# EAGLE design (Eagle)DriveUnit_B-series(ver1.0) (EAGLE 9.6.2)
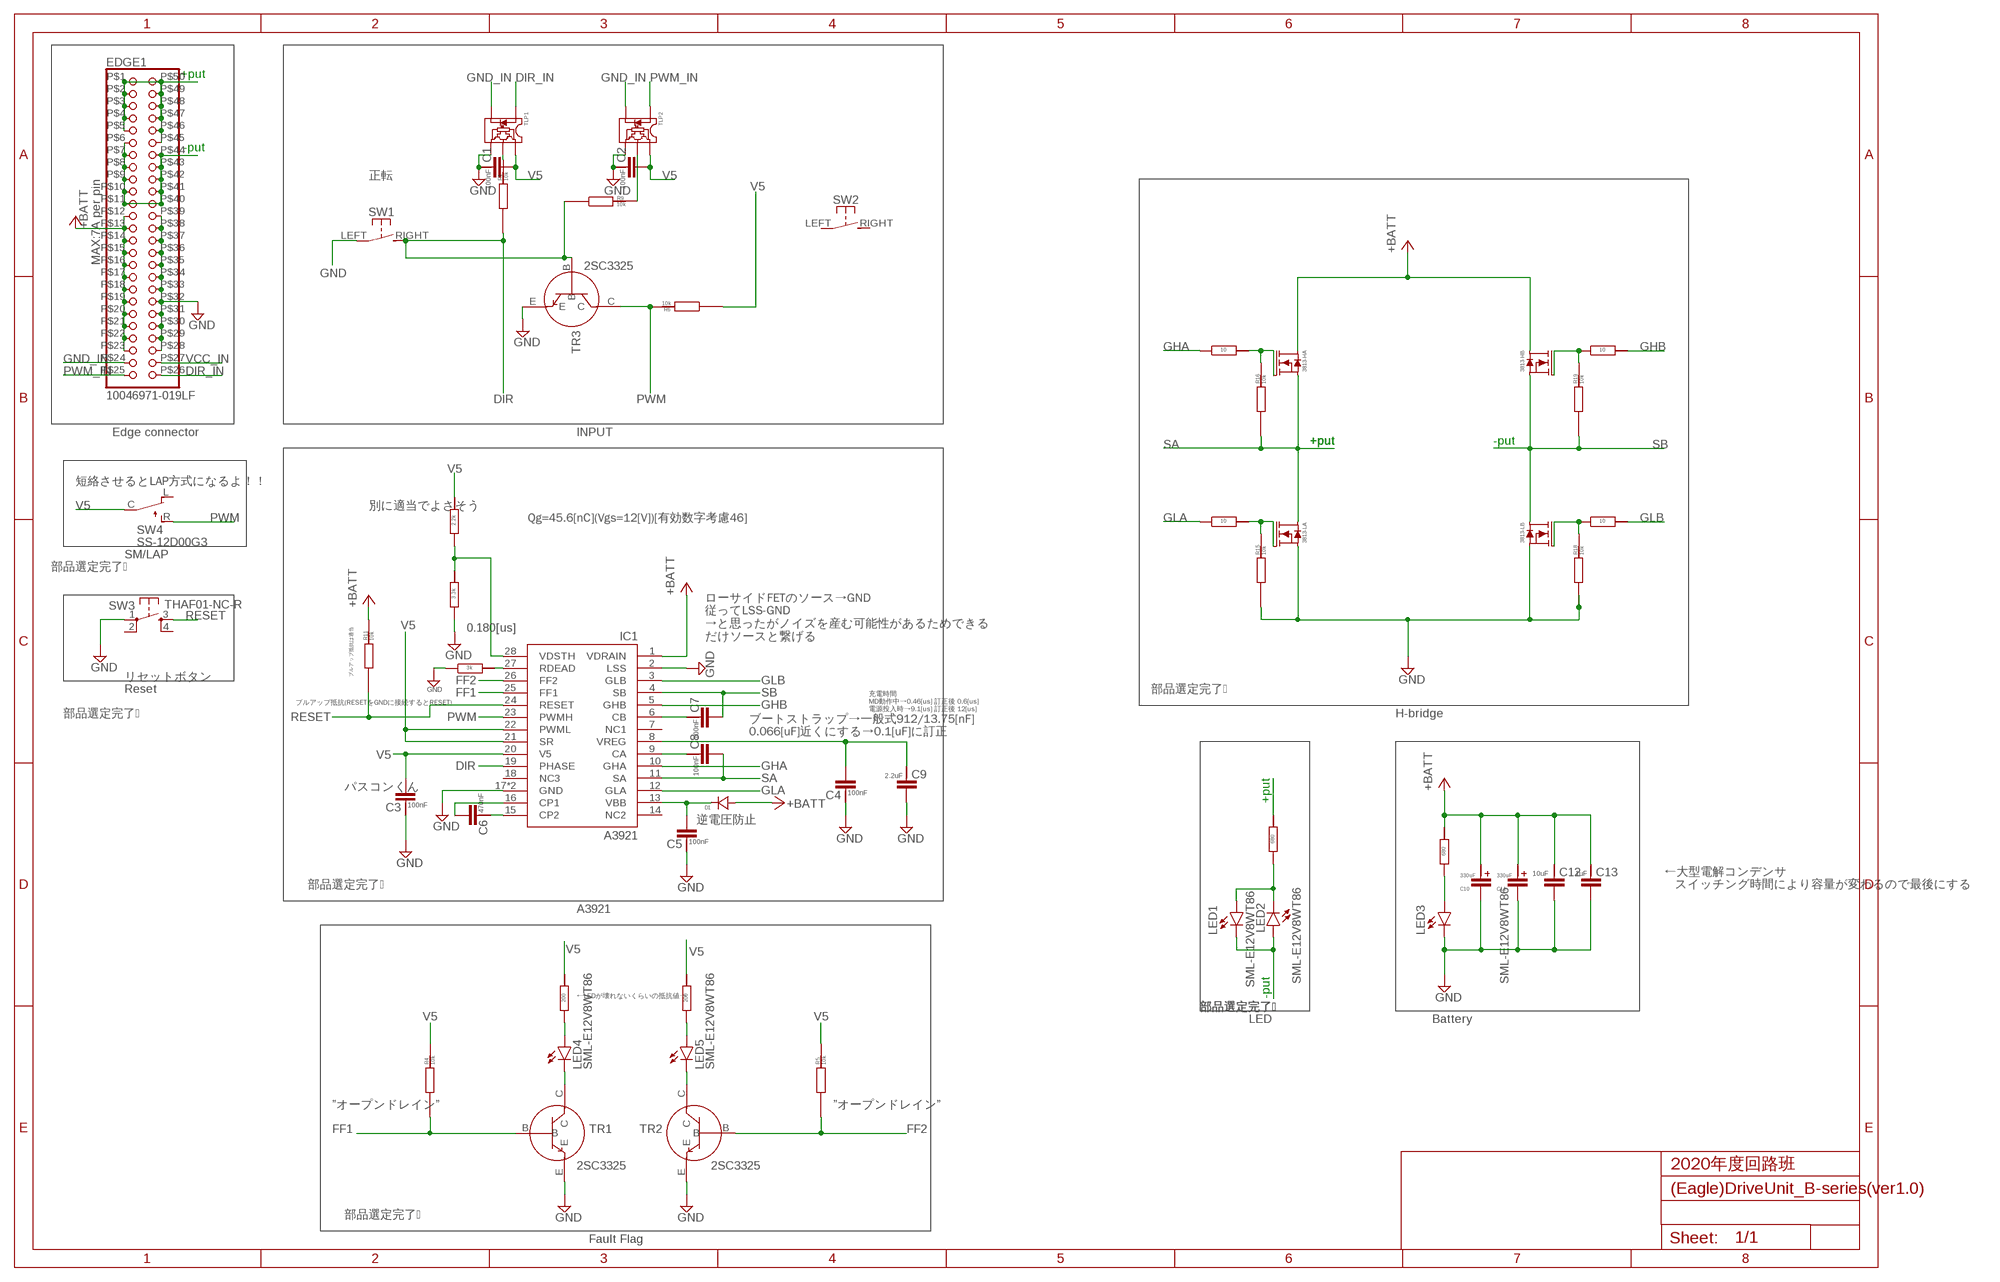
[diagram p0: schematic, sheet 1]

## Parts
3813-HA  IRLB3813NOHOLE  [TO-220AB-NOHOLE]
3813-HB  IRLB3813NOHOLE  [TO-220AB-NOHOLE]
3813-LA  IRLB3813NOHOLE  [TO-220AB-NOHOLE]
3813-LB  IRLB3813NOHOLE  [TO-220AB-NOHOLE]
C1  GCM188L81H104KA57  [GCM188L81H104KA57]
C2  GCM188L81H104KA57  [GCM188L81H104KA57]
C3  GCM188L81H104KA57  [GCM188L81H104KA57]
C4  GCM188L81H104KA57  [GCM188L81H104KA57]
C5  GCM188L81H104KA57  [GCM188L81H104KA57]
C6  GCM21BR71H474KA55  [GCM21BR71H474KA55]
C7  GCM188L81H104KA57  [GCM188L81H104KA57]
C8  GCM188L81H104KA57  [GCM188L81H104KA57]
C9  GRT31CC81H225KE01L  [GRT31CC81H225KE01L]
C10  35PZJ330M10X9  [35PZJ330M10X9]
C11  35PZJ330M10X9  [35PZJ330M10X9]
C12  GRM32ER7YA106KA12  [GRM32ER7YA106KA12]
C13  GRM21BC72A105KE01  [GRM21BC72A105KE01]
D1  GS1010FL  [GS1010FL]
EDGE1  10046971-019LF  [10046971-019LF]
IC1  A3921  [A3921]
LED1  SML-E12V8WT86  [SML-E12V8WT86]
LED2  SML-E12V8WT86  [SML-E12V8WT86]
LED3  SML-E12V8WT86  [SML-E12V8WT86]
LED4  SML-E12V8WT86  [SML-E12V8WT86]
LED5  SML-E12V8WT86  [SML-E12V8WT86]
R1  RG2012  [RG2012]
R2  RG2012N-332-W-T1  [RG2012]
R3  RG2012P-681-B-T5  [RG2012]
R4  RG2012  [RG2012]
R5  RG2012  [RG2012]
R6  RG2012  [RG2012]
R7  RG2012N-201-W-T1  [RG2012]
R8  RG2012N-201-W-T1  [RG2012]
R9  RG2012  [RG2012]
R10  RG2012Q-100-D-T5  [RG2012]
R11  RG2012  [RG2012]
R12  RG2012Q-100-D-T5  [RG2012]
R13  RG2012P-302-B-T5  [RG2012]
R14  RG2012N-222-W-T1  [RG2012]
R15  RG2012  [RG2012]
R16  RG2012  [RG2012]
R18  RG2012  [RG2012]
R19  RG2012  [RG2012]
R20  RG2012Q-100-D-T5  [RG2012]
R21  RG2012Q-100-D-T5  [RG2012]
R22  RG2012P-681-B-T5  [RG2012]
SW1  TVAF06-A020B-R  [TVAF06-A020B-R]
SW2  TVAF06-A020B-R  [TVAF06-A020B-R]
SW3  THAF01-NC-R  [THAF01-NC-R]
SW4  SS-12D00G3  [SS-12D00G3]
TLP1  TLP2366  [TLP2366]
TLP2  TLP2366  [TLP2366]
TR1  2SC3325  [2SC3325]
TR2  2SC3325  [2SC3325]
TR3  2SC3325  [2SC3325]

## Nets
DIR: IC1.19(PHASE) R1.LEFT R9.LEFT SW1.RIGHT(S) TR3.B
DIR_IN: EDGE1.P$26(P26) TLP1.1(ANODE)
FF1: IC1.25(FF1) R4.LEFT TR1.B
FF2: IC1.26(FF2) R5.LEFT TR2.B
GHA: IC1.10(GHA) R21.RIGHT
GHB: IC1.5(GHB) R12.LEFT
GLA: IC1.12(GLA) R20.RIGHT
GLB: IC1.3(GLB) R10.LEFT
GND: 3813-LA.SOURCE(S) 3813-LB.SOURCE(S) C1.P$1 C2.P$1 C3.P$1 C4.P$1 C5.P$1 C9.P$2 C10.C(CATHODE) C11.C(CATHODE) C12.P$2 C13.P$2 EDGE1.P$28(P28) EDGE1.P$29(P29) EDGE1.P$30(P30) EDGE1.P$31(P31) EDGE1.P$32(P32) EDGE1.P$33(P33) EDGE1.P$34(P34) EDGE1.P$35(P35) EDGE1.P$36(P36) EDGE1.P$37(P37) EDGE1.P$38(P38) EDGE1.P$39(P39) IC1.2(LSS) IC1.17(GND) IC1.PAD(GND) LED3.K(C) R2.RIGHT R13.RIGHT R15.LEFT R18.LEFT SW1.LEFT(P) SW3.1 TLP1.4(GND) TLP2.4(GND) TR1.E TR2.E TR3.E
GND_IN: EDGE1.P$24(P24) TLP1.3(CATHODE) TLP2.3(CATHODE)
N$1: C6.P$1 IC1.15(CP2)
N$2: C6.P$2 IC1.16(CP1)
N$3: C7.P$1 IC1.6(CB)
N$4: IC1.28(VDSTH) R2.LEFT R14.RIGHT
N$5: LED4.K(C) TR1.C
N$6: C4.P$2 C9.P$1 IC1.8(VREG)
N$7: C5.P$2 D1.C IC1.13(VBB)
N$8: LED5.K(C) TR2.C
N$9: LED4.A R7.RIGHT
N$10: LED5.A R8.RIGHT
N$11: R1.RIGHT TLP1.5(VOUT)
N$13: 3813-HA.GATE(G) R16.RIGHT R21.LEFT
N$14: R9.RIGHT TLP2.5(VOUT)
N$15: C8.P$1 IC1.9(CA)
N$16: IC1.27(RDEAD) R13.LEFT
N$18: LED1.A LED2.K(C) R3.RIGHT
N$21: 3813-HB.GATE(G) R12.RIGHT R19.RIGHT
N$22: LED3.A R22.RIGHT
N$25: 3813-LA.GATE(G) R15.RIGHT R20.LEFT
N$26: 3813-LB.GATE(G) R10.RIGHT R18.RIGHT
PWM: IC1.23(PWMH) R6.RIGHT SW4.R TR3.C
PWM_IN: EDGE1.P$25(P25) TLP2.1(ANODE)
RESET: IC1.24(RESET) R11.LEFT SW3.3
SA: 3813-HA.SOURCE(S) 3813-LA.DRAIN(D) C8.P$2 EDGE1.P$1(P1) EDGE1.P$2(P2) EDGE1.P$3(P3) EDGE1.P$4(P4) EDGE1.P$5(P5) EDGE1.P$45(P45) EDGE1.P$46(P46) EDGE1.P$47(P47) EDGE1.P$48(P48) EDGE1.P$49(P49) EDGE1.P$50(P50) IC1.11(SA) R3.LEFT R16.LEFT
SB: 3813-HB.SOURCE(S) 3813-LB.DRAIN(D) C7.P$2 EDGE1.P$6(P6) EDGE1.P$7(P7) EDGE1.P$8(P8) EDGE1.P$9(P9) EDGE1.P$10(P10) EDGE1.P$11(P11) EDGE1.P$40(P40) EDGE1.P$41(P41) EDGE1.P$42(P42) EDGE1.P$43(P43) EDGE1.P$44(P44) IC1.4(SB) LED1.K(C) LED2.A R19.LEFT
V5: C1.P$2 C2.P$2 C3.P$2 IC1.20(V5) IC1.21(SR) IC1.22(PWML) R4.RIGHT R5.RIGHT R6.LEFT R7.LEFT R8.LEFT R14.LEFT SW4.C TLP1.6(VCC) TLP2.6(VCC)
VCC: 3813-HA.DRAIN(D) 3813-HB.DRAIN(D) C10.A(ANODE) C11.A(ANODE) C12.P$1 C13.P$1 D1.A EDGE1.P$12(P12) EDGE1.P$13(P13) EDGE1.P$14(P14) EDGE1.P$15(P15) EDGE1.P$16(P16) EDGE1.P$17(P17) EDGE1.P$18(P18) EDGE1.P$19(P19) EDGE1.P$20(P20) EDGE1.P$21(P21) EDGE1.P$22(P22) EDGE1.P$23(P23) IC1.1(VDRAIN) R11.RIGHT R22.LEFT ; supply symbol labelled +BATT
VCC_IN: EDGE1.P$27(P27)
Unconnected: IC1.7(NC1) IC1.14(NC2) IC1.18(NC3) SW2.LEFT(P) SW2.RIGHT(S) SW3.2 SW3.4 SW4.L

## Notes on the sheet
- +put
- -put
- 正転
- Edge connector | INPUT
- +put | +put | -put
- V5
- 短絡させるとLAP方式になるよ！！
- 別に適当でよさそう
- Qg=45.6[nC](Vgs=12[V])[有効数字考慮46]
- SM/LAP
- 部品選定完了☑
- 0.180[us]
- ローサイドFETのソース→GND
  従ってLSS-GND
  →と思ったがノイズを産む可能性があるためできる
  だけソースと繋げる
- プルアップ抵抗は適当
- リセットボタン
- FF2 | GLB
- Reset | 部品選定完了☑
- FF1 | SB
- プルアップ抵抗(RESETをGNDに接続するとRESET)
- GHB
- 充電時間
  MD動作中→0.46[us] 訂正後 0.6[us]
  電源投入時→9.1[us] 訂正後 12[us]
- 部品選定完了☑ | H-bridge
- RESET
- ブートストラップ→一般式912/13.75[nF]
  0.066[uF]近くにする→0.1[uF]に訂正
- V5
- SA
- パスコンくん
- +put
- 逆電圧防止
- 部品選定完了☑
- ←大型電解コンデンサ
     スイッチング時間により容量が変わるので最後にする
- A3921
- V5 | V5
- ←LEDが壊れないくらいの抵抗値→ | -put
- 部品選定完了☑ | 部品選定完了☑
- LED | Battery
- ”オープンドレイン” | ”オープンドレイン”
- 2020年度回路班
- 部品選定完了☑
- Fault Flag

## Library data of the parts
3813-HA 3813-HB 3813-LA 3813-LB = OKUDA_libraries:IRLB3813
C1-C5 C7 C8 = GCM188L81H104K57(0.1uF):GCM188L81H104KA57
C6 = GCM21BR71H474KA55(0.47uF):GCM21BR71H474KA55
C9 = GRT31CC81H225KE01L:GRT31CC81H225KE01L
C10 C11 = 35PZJ330M10X9:35PZJ330M10X9
C12 = GRM32ER7YA106KA12(10uF):GRM32ER7YA106KA12
C13 = GRM21BC72A105KE01(1uF):GRM21BC72A105KE01
D1 = GS1010FL:GS1010FL
EDGE1 = 10046971-019LF:10046971-019LF
IC1 = A3921:A3921
LED1-LED5 = SML-E12V8WT86:SML-E12V8WT86
R1 R4-R6 R9 R11 R15 R16 R18 R19 = RG2012:RG2012
R2 = RG2012N-332-W-T1:RG2012N-332-W-T1
R3 R22 = RG2012P-681-B-T5:RG2012P-681-B-T5
R7 R8 = RG2012N-201-W-T1:RG2012N-201-W-T1
R10 R12 R20 R21 = RG2012Q-100-D-T5:RG2012Q-100-D-T5
R13 = RG2012P-302-B-T5:RG2012P-302-B-T5
R14 = RG2012N-222-W-T1:RG2012N-222-W-T1
SW1 SW2 = TVAF06-A020B-R:TVAF06-A020B-R
SW3 = THAF01-NC-R:THAF01-NC-R
SW4 = SS-12D00G3:SS-12D00G3
TLP1 TLP2 = TLP2366:TLP2366
TR1-TR3 = 2SC3325:2SC3325

## Board
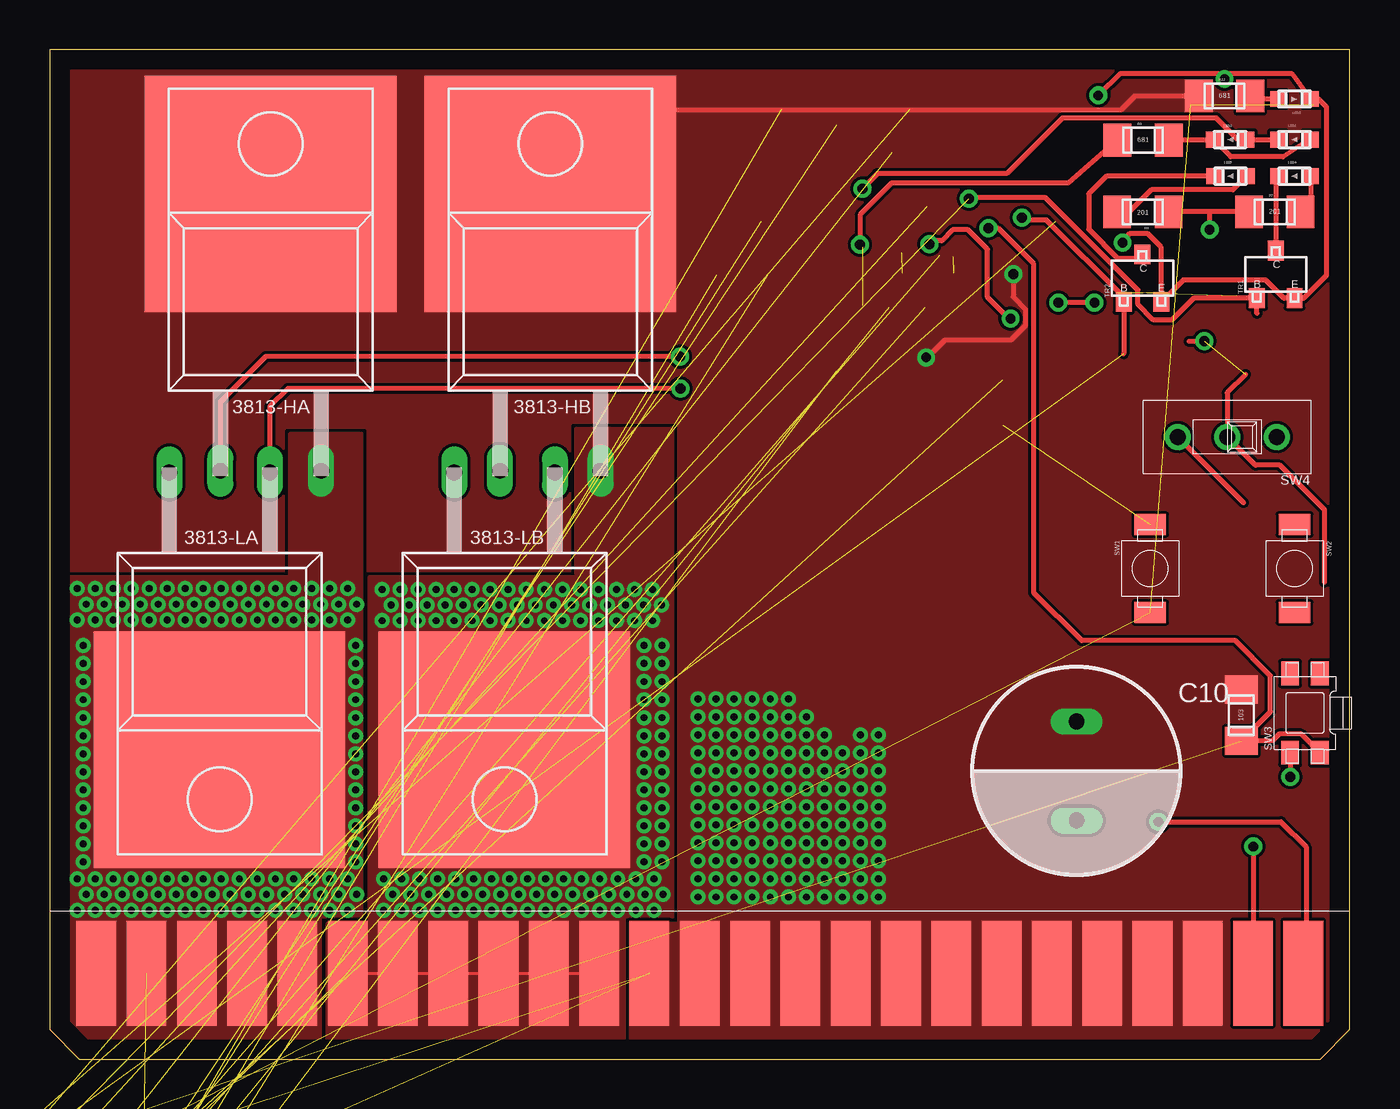
[diagram p1: board, top side]
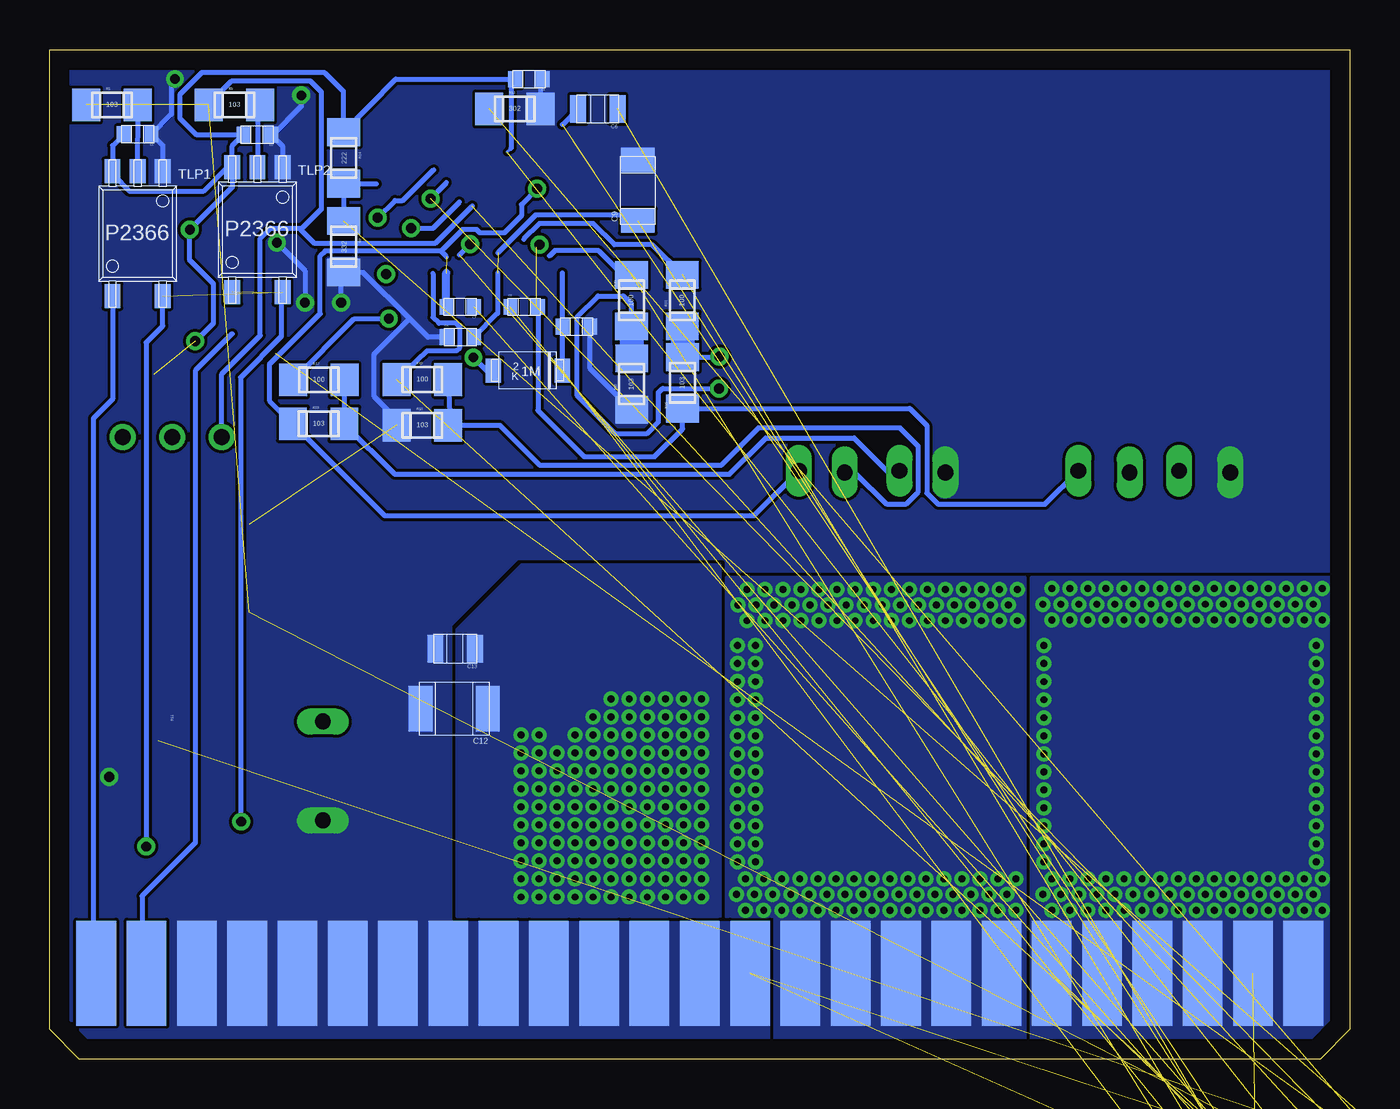
[diagram p2: board, bottom side, seen from below]

Size 65.68 x 51 mm. Coordinates in mm from the lower left corner, seen from the top.
Outline: 0,51 0,1.5 1.5,0 64.18,0 65.68,1.5 65.68,51 0,51
Copper layers (1*16): Top 0.035mm / dielectric 1.5mm / Bottom 0.035mm
Design rules "default": minimum track width 6mil, minimum drill 0.35mm, track to track 6mil, track to pad 6mil, pad to pad 6mil, via to via 6mil, smd to smd 6mil, copper to edge 40mil, drill to drill 6mil, minimum pad ring 10mil, minimum via ring 8mil, stop-mask expansion 4mil, vias tented up to drill 0mil, thermal gap 10mil

### Footprints (pad centres in the part's own frame; a part is rotated, then mirrored left to right if it is on the bottom)
TO-220AB-NOHOLE = smd 12.7 x 11.938: DRAIN 0,8.915 | drill 0.8 long: GATE -2.54,-5.08; SOURCE 2.54,-5.08
GCM188L81H104KA57 = smd 0.7 x 0.8: P$1 -0.7,0; P$2 0.7,0
GCM21BR71H474KA55 = smd 0.8 x 1.4: P$1 -1,0; P$2 1,0
GRT31CC81H225KE01L = smd 1.2 x 1.7: P$1 -1.55,0; P$2 1.55,0
35PZJ330M10X9 = drill 0.8 long: A 0,2.5; C 0,-2.5
GRM32ER7YA106KA12 = smd 1.2 x 2.3: P$1 -1.7,0; P$2 1.7,0
GRM21BC72A105KE01 = smd 0.8 x 1.4: P$1 -1,0; P$2 1,0
GS1010FL = smd 0.78 x 1.22: A 3.48,0; C 0,0
10046971-019LF = smd 2 x 5.3: P$1 -30.48,0; P$2 -27.94,0; P$3 -25.4,0; P$4 -22.86,0; P$5 -20.32,0; P$6 -17.78,0; P$7 -15.24,0; P$8 -12.7,0; P$9 -10.16,0; P$10 -7.62,0; P$11 -5.08,0; P$12 -2.54,0; P$13 0,0; P$14 2.54,0; P$15 5.08,0; P$16 7.62,0; P$17 10.16,0; P$18 12.7,0; P$19 15.24,0; P$20 17.78,0; P$21 20.32,0; P$22 22.86,0; P$23 25.4,0; P$24 27.94,0; P$25 30.48,0 | smd 2 x 5.3 bottom: P$26 30.48,0; P$27 27.94,0; P$28 25.4,0; P$29 22.86,0; P$30 20.32,0; P$31 17.78,0; P$32 15.24,0; P$33 12.7,0; P$34 10.16,0; P$35 7.62,0; P$36 5.08,0; P$37 2.54,0; P$38 0,0; P$39 -2.54,0; P$40 -5.08,0; P$41 -7.62,0; P$42 -10.16,0; P$43 -12.7,0; P$44 -15.24,0; P$45 -17.78,0; P$46 -20.32,0; P$47 -22.86,0; P$48 -25.4,0; P$49 -27.94,0; P$50 -30.48,0
A3921 = smd 0.45 x 1.65: 1 0,-0.9; 2 0.65,-0.9; 3 1.3,-0.9; 4 1.95,-0.9; 5 2.6,-0.9; 6 3.25,-0.9; 7 3.9,-0.9; 8 4.55,-0.9; 9 5.2,-0.9; 10 5.85,-0.9; 11 6.5,-0.9; 12 7.15,-0.9; 13 7.8,-0.9; 14 8.45,-0.9; 15 8.45,5.2; 16 7.8,5.2; 17 7.15,5.2; 18 6.5,5.2; 19 5.85,5.2; 20 5.2,5.2; 21 4.55,5.2; 22 3.9,5.2; 23 3.25,5.2; 24 2.6,5.2; 25 1.95,5.2; 26 1.3,5.2; 27 0.65,5.2; 28 0,5.2 | smd 5 x 3: PAD 4.225,2.15
SML-E12V8WT86 = smd 0.8 x 0.8: A 0,1.65; K 0,0
RG2012 = smd 1.4 x 1.65: LEFT 0,0; RIGHT 2.6,0
TVAF06-A020B-R = smd 1.05 x 1.6: LEFT 0,0; RIGHT 4.45,0
THAF01-NC-R = smd 1.2 x 0.9: 1 0,1.5; 2 4,1.5; 3 0,0; 4 4,0
SS-12D00G3 = drill 0.8: C 0,0; L -2.5,0; R 2.5,0
TLP2366 = smd 0.8 x 1.2: 1 0,0; 3 2.54,0; 4 2.54,6.3; 5 1.27,6.3; 6 0,6.3
2SC3325 = smd 1 x 0.8: B 0,1.9; C 2.4,0.95; E 0,0

### Placement (x,y rotation side)
3813-HA  11.17,34.8 0 top
3813-HB  25.29,34.8 0 top
3813-LA  8.59,24.56 180 top
3813-LB  22.98,24.56 180 top
C1  61.23,46.72 180 bottom
C2  55.19,46.7 180 bottom
C3  41.47,49.5 180 bottom
C4  44.93,36.47 0 bottom
C5  39.07,37 180 bottom
C6  37.99,48 180 bottom
C7  44.94,38 180 bottom
C8  41.71,38 0 bottom
C9  35.97,43.89 90 bottom
C10  51.87,14.56 0 top
C11  1.82,-32.76 0 top  (outside the outline)
C12  45.24,17.71 180 bottom
C13  45.19,20.73 180 bottom
D1  39.78,34.79 180 bottom
EDGE1  32.84,4.35 0 top
IC1  -1.82,-9.1 0 top  (outside the outline)
LED1  62.05,46.45 270 top
LED2  58.8,46.45 270 top
LED3  63.7,48.5 90 top
LED4  62.05,44.6 270 top
LED5  58.82,44.6 270 top
R1  63.83,48.2 0 bottom
R2  50.83,42.34 270 bottom
R3  53.93,46.42 0 top
R4  -2.73,-12.74 0 top  (outside the outline)
R5  -2.73,-15.47 0 top  (outside the outline)
R6  -7.28,-40.04 0 top  (outside the outline)
R7  60.58,42.8 0 top
R8  56.52,42.8 180 top
R9  57.64,48.2 0 bottom
R10  48.15,34.33 0 bottom
R11  60.19,16.08 90 top
R12  53.38,34.31 0 bottom
R13  43.48,48 0 bottom
R14  50.83,46.82 270 bottom
R15  36.28,32.8 90 bottom
R16  33.71,32.86 90 bottom
R18  48.15,32.02 0 bottom
R19  53.39,32.09 0 bottom
R20  36.29,37.02 90 bottom
R21  33.72,37.02 90 bottom
R22  58.05,48.65 0 top
SW1  55.59,27.01 270 top
SW2  62.88,27.01 270 top
SW3  64.15,15.49 90 top
SW4  59.48,31.43 180 top
TLP1  62.5,38.55 0 bottom
TLP2  56.45,38.75 0 bottom
TR1  62.88,38.44 90 top
TR2  56.15,38.25 90 top
TR3  -7.28,-37.31 0 top  (outside the outline)

### Tracks (layer width: path | path; a pad name or v marks a point on that pad's centre or on a via)
DIR  (4 unrouted)
DIR_IN
  Bottom 0.152: 63.47,4.5 EDGE1.P$26
  Bottom 0.254: TLP1.1 62.5,33.34 63.47,32.37 63.47,4.5
FF1  (via drill 0.5)  (2 unrouted)
  Top 0.254: 60.98,37.67 TR1.B 57.78,38.44 56.68,37.34 55.76,37.34 54.97,38.13 54.97,38.85 50.31,43.51 46.48,43.51 v46.44,43.47
  Bottom 0.254: v46.44,43.47 45.63,44.28
FF2  (via drill 0.5)  (2 unrouted)
  Top 0.254: 54.25,35.64 TR2.B 54.25,38.49 50.35,42.39 49.21,42.39 v49.1,42.5
  Bottom 0.254: v49.1,42.5 48.23,43.37 47.84,43.37 46.28,44.93
GHA  (1 unrouted)
  Bottom 0.254: R21.RIGHT 35.24,41.14 37.15,41.14 38.22,42.21 40.93,42.21 41.73,41.41
GHB  (via drill 0.5)  (1 unrouted)
  Top 0.152: v48.54,37.4 48.46,37.4
  Top 0.254: 48.46,37.4 47.37,38.49 47.37,40.91 46.39,41.89 45.61,41.89 45.06,41.34 44.62,41.34 v44.44,41.16
  Bottom 0.254: R12.LEFT 50.29,37.4 v48.54,37.4 | 44.98,40.62 v44.44,41.16
GLA  (1 unrouted)
  Bottom 0.152: R20.RIGHT 36.73,39.62
  Bottom 0.254: 36.73,39.62 37.95,40.84 40.16,40.84 40.43,40.57
GLB  (1 unrouted)
  Bottom 0.254: R10.LEFT 46.6,35.78 45.12,35.78 44.95,35.95 44.95,36.98 45.13,37.17 46.01,37.17 46.31,37.47 46.31,39.69
GND  (via drill 0.49, 0.5)  (6 unrouted)
  Top 0.152: LED3.K 64.09,48.5 | v52.96,48.68 52.98,48.68 | SW3.1 62.67,15.47
  Top 0.254: 64.09,48.5 64.49,48.1 64.49,39.59 63.34,38.44 TR1.E 62.34,38.44 61.42,39.36 57.26,39.36 TR2.E 56.15,41.01 55.48,41.69 54.54,41.69 54.2,41.34 v54.2,41.24 | LED3.K 62.76,49.77 59.59,49.77 v59.34,49.52 59.31,49.48 59.01,49.78 54.09,49.78 52.98,48.68 | v52.78,38.22 v50.96,38.22 | 62.67,15.47 v62.67,14.27
  Bottom 0.152: C2.P$1 54.44,46.65 | C3.P$1 40.88,49.39 | 59.31,49.52 v59.34,49.52
  Bottom 0.254: 47.49,37.41 49.83,39.74 R2.RIGHT | 47.49,37.41 46.56,36.47 C4.P$1 | TLP1.4 59.96,46.15 C1.P$1 59.53,47.72 59.53,49.11 59.31,49.33 59.31,49.52 | TLP2.4 53.91,46.12 54.44,46.65 52.96,48.13 v52.96,48.68 | 40.88,49.39 R13.RIGHT 40.43,47.55 | R18.LEFT 48.06,32.26 49.28,33.47 49.28,35.62 47.49,37.41 | R15.LEFT 38.37,34.89 C5.P$1 | v54.2,41.24 52.78,39.83 v52.78,38.22 | v50.96,38.22 50.96,39.61
  pour Bottom (rank 3, no thermals): -4,52 -4,-2 69.73,-2 69.73,52
GND_IN  (via drill 0.5)  (1 unrouted)
  Top 0.152: 60.8,4.37 EDGE1.P$24
  Top 0.254: v60.8,10.74 60.8,4.37
  Bottom 0.254: v60.8,10.74 60.8,36.2 59.96,37.04 TLP1.3
N$1  (1 unrouted)
N$2  (1 unrouted)
  Bottom 0.254: C6.P$2 39.78,47.21
N$3  (1 unrouted)
N$4  (1 unrouted)
  Bottom 0.254: R2.LEFT R14.RIGHT 49.18,44.22
N$5
  Top 0.152: LED4.K 61.93,44.8
  Top 0.254: 61.93,44.8 TR1.C
N$6  (2 unrouted)
  Bottom 0.254: C4.P$2 43.04,37.68 43.04,39.71 | C9.P$1 36.28,42.65 41.11,42.65 43.03,40.73
N$7  (1 unrouted)
  Bottom 0.152: C5.P$2
  Bottom 0.254: C5.P$2 39.77,39.71 | D1.C C5.P$2
N$8
  Top 0.254: LED5.K 53.37,44.6 52.48,43.71 52.48,41.92 53.96,40.44 54.99,40.44 TR2.C
N$9
  Top 0.152: 63.7,43.32 R7.RIGHT
  Top 0.254: LED4.A 63.7,43.32
N$10
  Top 0.254: R8.RIGHT 54.54,42.8 55.66,43.91 59.76,43.91 60.45,44.6 LED5.A
N$11
  Bottom 0.152: TLP1.5
  Bottom 0.254: R1.RIGHT TLP1.5
N$13  (via drill 0.5)
  Top 0.254: v31.85,35.49 10.92,35.49 8.63,33.2 3813-HA.GATE
  Bottom 0.152: R21.LEFT | 31.88,35.46 v31.85,35.49
  Bottom 0.254: R16.RIGHT 31.88,35.46
  Bottom 1.2: R21.LEFT R16.RIGHT
N$14
  Bottom 0.152: R9.RIGHT 55.17,48.2 | TLP2.5
  Bottom 0.254: 55.17,48.2 TLP2.5
N$15  (1 unrouted)
N$16  (1 unrouted)
N$18
  Top 0.152: LED1.A 63.59,46.45 | 58.8,46.43 LED2.K 58.77,46.42
  Top 0.254: 63.59,46.45 62.3,45.58 59.65,45.58 58.8,46.43 | 58.77,46.42 R3.RIGHT
N$21
  Bottom 0.152: R12.RIGHT
  Bottom 0.254: R12.RIGHT R19.RIGHT 48.25,29.55 31.33,29.55 29.5,31.38 25.05,31.38 23.29,29.62 3813-HB.GATE
N$22
  Top 0.152: 60.51,48.5 R22.RIGHT
  Top 0.254: LED3.A 60.51,48.5
N$25  (via drill 0.5)
  Top 0.254: 3813-LA.GATE 11.13,32.97 12.04,33.88 v31.86,33.88
  Bottom 0.152: R15.RIGHT | 36.31,37.02 R20.LEFT
  Bottom 0.254: 36.31,37.02 36.31,38.17 36.69,38.55 37.98,38.55 39.03,37.5 39.03,33.52 37.09,31.58 35.54,31.58 34.93,32.2 34.93,33.67 34.72,33.88 v31.86,33.88
  Bottom 1.2: R20.LEFT R15.RIGHT
N$26
  Bottom 0.152: R18.RIGHT 45.45,32.03
  Bottom 0.254: R10.RIGHT 45.45,32.03 | R18.RIGHT 42.94,32.02 40.93,30.01 31.75,30.01 29.88,31.88 22.73,31.88 21.8,30.95 21.8,28.65 22.4,28.04 23.42,28.04 25.02,29.64 3813-LB.GATE
PWM  (3 unrouted)
  Top 0.254: 60.31,28.1 SW4.R
  Bottom 0.254: 57.63,48.26 56.48,49.41 52.52,49.41 51.96,48.86 51.96,42.93 52.91,41.98 | 44.33,43.09 46.19,41.23 52.32,41.23 52.99,41.9 52.91,41.98 | SW4.R 56.98,34.6 55.03,36.55 55.03,41.47 54.52,41.98 52.91,41.98
PWM_IN  (via drill 0.5)  (1 unrouted)
  Top 0.152: 63.47,4.5 EDGE1.P$25
  Top 0.254: 63.47,4.5 63.47,10.72 62.19,12 v56,12
  Bottom 0.152: 56.03,12.03 v56,12
  Bottom 0.254: 56.03,12.03 56.03,34.44 53.97,36.5 53.97,38.69
RESET  (via drill 0.5)  (1 unrouted)
  Top 0.254: v47.42,41.97 47.92,41.97 49.71,40.18 49.71,23.56 52.13,21.14 59.89,21.14 61.66,19.37 61.66,17.55 R11.LEFT 61.76,16.08 62.1,16.43 63.22,16.43 SW3.3
  Bottom 0.254: v47.42,41.97 46.31,41.97 44.98,43.3
SA  (via drill 0.35, 0.5)  (2 unrouted)
  Top 0.254: R3.LEFT 51.45,44.25 42.53,44.25 40.94,42.66 v40.94,41.15
  Bottom 0.152: R16.LEFT 33.7,32.88
  Bottom 0.254: v40.94,41.15 41.08,41.01 | C8.P$2 41.01,32.77 38.67,30.43 35.12,30.43 33.71,31.84 R16.LEFT | 33.7,32.88 22.23,32.88 21.37,32.02 21.37,28.59 20.81,28.03 15.4,28.03 3813-HA.SOURCE
  Bottom 0.406: 41.08,38.07 C8.P$2
  other vias: 1.4,9.11 2.31,9.11 1.85,8.32 5.5,8.32 2.77,8.32 3.22,9.11 1.4,7.53 2.31,7.53 3.22,7.53 4.13,7.53 13.23,7.53 12.32,7.53 11.41,7.53 10.5,7.53 9.59,7.53 8.68,7.53 7.77,7.53 6.86,7.53 5.95,7.53 5.04,7.53 4.58,8.32 3.67,8.32 4.13,9.11 5.04,9.11 5.95,9.11 6.41,8.32 7.32,8.32 6.86,9.11 7.77,9.11 8.22,8.32 9.13,8.32 8.68,9.11 10.04,8.32 10.96,8.32 9.59,9.11 10.5,9.11 11.41,9.11 11.87,8.32 12.78,8.32 13.69,8.32 14.6,8.32 15.51,8.32 15.05,9.11 13.23,9.11 14.14,9.11 12.32,9.11 1.71,9.97 1.71,10.88 1.71,11.79 1.71,12.7 1.4,23.77 2.31,23.77 1.85,22.98 5.5,22.98 2.77,22.98 3.22,23.77 1.4,22.19 2.31,22.19 3.22,22.19 4.13,22.19 13.23,22.19 12.32,22.19 11.41,22.19 10.5,22.19 9.59,22.19 8.68,22.19 7.77,22.19 6.86,22.19 5.95,22.19 5.04,22.19 4.58,22.98 3.67,22.98 4.13,23.77 5.04,23.77 5.95,23.77 6.41,22.98 7.32,22.98 6.86,23.77 7.77,23.77 8.22,22.98 9.13,22.98 8.68,23.77 10.04,22.98 10.96,22.98 9.59,23.77 10.5,23.77 11.41,23.77 11.87,22.98 12.78,22.98 13.69,22.98 14.6,22.98 15.51,22.98 15.05,23.77 13.23,23.77 14.14,23.77 12.32,23.77 15.05,22.19 14.14,22.19 14.14,7.53 15.05,7.53 1.71,13.61 1.71,14.52 1.71,15.43 1.71,16.34 1.71,17.25 1.71,18.16 1.71,19.07 1.71,19.98 1.71,20.89 15.47,9.97 15.47,10.88 15.47,11.79 15.47,12.7 15.47,13.61 15.47,14.52 15.47,15.43 15.47,16.34 15.47,17.25 15.47,18.16 15.47,19.07 15.47,19.98 15.47,20.89
  pour Bottom (no thermals): 16.1,24.35 -0.91,24.35 -0.91,-0.82 16.1,-0.82
  pour Top (no thermals): 15.79,31.59 12.11,31.59 12.11,24.35 -0.91,24.35 -0.91,-0.91 13.69,-0.91 13.69,7.18 15.79,7.18
SB  (via drill 0.35, 0.5)  (2 unrouted)
  Top 0.152: EDGE1.P$40 27.5,4.5 27,4.5 EDGE1.P$40 | EDGE1.P$6 EDGE1.P$40
  Top 0.254: LED1.K LED2.A 60.01,46.45 58.93,47.53 51.14,47.53 48.34,44.73 41.81,44.73 v41.05,43.97
  Bottom 0.152: R19.LEFT 53.33,32.03 | 25.5,4.5 25.5,6.5 | 27.5,4.5 EDGE1.P$40
  Bottom 0.254: 3813-HB.SOURCE 30.09,27.45 48.76,27.45 53.33,32.03 54.58,33.28 54.58,35.08 52,37.66 52,40.59 51.77,40.82 45.92,40.82 45.91,40.82 | v41.05,43.97 41.85,43.17 41.85,42.6 42.72,41.73 43.94,41.73 44.11,41.91 44.82,41.91 45.91,40.82 | 45.63,40.53 45.91,40.82
  Bottom 0.406: C7.P$2 45.64,39.71
  other vias: 16.8,23.73 17.71,23.73 17.25,22.94 20.89,22.94 18.16,22.94 18.62,23.73 16.8,22.15 17.71,22.15 18.62,22.15 19.53,22.15 28.63,22.15 27.72,22.15 26.81,22.15 25.9,22.15 24.99,22.15 24.08,22.15 23.17,22.15 22.26,22.15 21.35,22.15 20.44,22.15 19.98,22.94 19.07,22.94 19.53,23.73 20.44,23.73 21.35,23.73 21.8,22.94 22.71,22.94 22.26,23.73 23.17,23.73 23.62,22.94 24.54,22.94 24.08,23.73 25.45,22.94 26.36,22.94 24.99,23.73 25.9,23.73 26.81,23.73 27.27,22.94 28.18,22.94 29.09,22.94 30,22.94 30.91,22.94 30.45,23.73 28.63,23.73 29.54,23.73 27.72,23.73 29.54,22.15 30.45,22.15 16.87,9.11 17.78,9.11 17.32,8.32 20.96,8.32 18.23,8.32 18.69,9.11 16.87,7.53 17.78,7.53 18.69,7.53 19.6,7.53 28.7,7.53 27.79,7.53 26.88,7.53 25.97,7.53 25.06,7.53 24.15,7.53 23.24,7.53 22.33,7.53 21.42,7.53 20.51,7.53 20.05,8.32 19.14,8.32 19.6,9.11 20.51,9.11 21.42,9.11 21.88,8.32 22.79,8.32 22.33,9.11 23.24,9.11 23.7,8.32 24.61,8.32 24.15,9.11 25.52,8.32 26.43,8.32 25.06,9.11 25.97,9.11 26.88,9.11 27.34,8.32 28.25,8.32 29.16,8.32 30.07,8.32 30.98,8.32 30.52,9.11 28.7,9.11 29.61,9.11 27.79,9.11 29.61,7.53 30.52,7.53 30.94,9.97 30.94,10.88 30.94,11.79 30.94,12.7 30.94,13.61 30.94,14.52 30.94,15.43 30.94,16.34 30.94,17.25 30.94,18.16 30.94,19.07 30.94,19.98 30.94,20.89 30.03,9.97 30.03,10.88 30.03,11.79 30.03,12.7 30.03,13.61 30.03,14.52 30.03,15.43 30.03,16.34 30.03,17.25 30.03,18.16 30.03,19.07 30.03,19.98 30.03,20.89
  pour Bottom (no thermals): 16.41,24.35 16.41,-0.91 29.05,-0.91 29.05,7.18 31.5,7.18 31.5,24.35
  pour Top (no thermals): 26.56,31.85 26.56,24.35 16.11,24.35 16.11,6.86 14,6.86 14,-0.91 29.05,-0.91 29.05,7.18 31.5,7.18 31.5,31.85
V5  (via drill 0.5)  (7 unrouted)
  Top 0.254: 64.4,24.08 64.4,27.74 62.14,30 60.91,30 SW4.C 59.48,33.66 60.41,34.59 | R7.LEFT 58.59,42.8 | 58.59,42.8 R8.LEFT | v58.59,41.9 58.59,42.8 | 57.56,36.27 v58.32,36.27
  Bottom 0.152: C3.P$2 42.38,49.29 | 42.56,45.82 42.38,46 | TLP2.6 56.7,45.05 | 62.5,44.71 TLP1.6
  Bottom 0.254: 42.38,49.29 42.38,46 | C1.P$2 62.5,46.15 TLP1.6 | C3.P$2 48.19,49.5 R14.LEFT 50.83,48.87 51.79,49.83 57.99,49.83 59.1,48.72 59.1,47.53 58.27,46.7 C2.P$2 56.45,46.14 TLP2.6 56.45,44.04 v58.59,41.9 58.59,40.35 57.39,39.15 57.39,37.18 58.3,36.27 v58.32,36.27 | 56.7,45.05 57.92,43.83 61.62,43.83 62.5,44.71
VCC  (via drill 0.35, 0.5)  (2 unrouted)
  Top 0.152: 3813-HB.DRAIN 25.29,43 30.23,47.94 | 44.32,35.41 v44.27,35.45 | 11.54,44 3813-HA.DRAIN
  Top 0.254: R22.LEFT 54.81,48.65 54.1,47.94 30.23,47.94 | 44.32,35.41 45.23,36.32 48.56,36.32 49.3,37.06 49.3,37.87 48.67,38.5 v48.67,39.66
  Bottom 0.152: 48.61,39.72 v48.67,39.66 | 43.62,34.79 D1.A
  Bottom 0.254: v44.27,35.45 43.62,34.79
  other vias: 34.58,18.2 34.58,17.29 34.58,16.38 34.58,15.47 34.58,14.56 34.58,13.65 34.58,12.74 34.58,11.83 34.58,10.92 34.58,10.01 34.58,9.1 34.58,8.19 35.49,8.19 36.4,8.19 37.31,8.19 38.22,8.19 39.13,8.19 40.04,8.19 40.95,8.19 40.95,9.1 40.04,9.1 39.13,9.1 35.49,9.1 35.49,10.01 35.49,10.92 36.4,9.1 37.31,9.1 38.22,9.1 38.22,10.01 37.31,10.01 36.4,10.01 39.13,10.01 40.04,10.01 40.95,10.01 40.95,10.92 36.4,10.92 37.31,10.92 38.22,10.92 39.13,10.92 35.49,18.2 35.49,17.29 35.49,16.38 35.49,15.47 35.49,14.56 35.49,13.65 35.49,12.74 35.49,11.83 36.4,11.83 40.04,10.92 37.31,11.83 38.22,11.83 39.13,11.83 40.04,11.83 40.95,11.83 36.4,12.74 37.31,12.74 36.4,13.65 37.31,13.65 38.22,13.65 38.22,12.74 39.13,12.74 40.04,12.74 40.95,12.74 40.95,13.65 40.04,13.65 39.13,13.65 36.4,14.56 37.31,14.56 38.22,14.56 40.95,16.38 40.95,15.47 40.95,14.56 40.04,14.56 39.13,14.56 40.04,15.47 39.13,15.47 38.22,15.47 37.31,15.47 36.4,15.47 36.4,16.38 37.31,16.38 38.22,16.38 39.13,16.38 38.22,17.29 37.31,17.29 36.4,17.29 36.4,18.2 37.31,18.2 41.86,8.19 41.86,9.1 41.86,10.01 41.86,10.92 41.86,11.83 41.86,12.74 41.86,13.65 41.86,16.38 41.86,15.47 41.86,14.56 33.67,18.2 33.67,17.29 33.67,16.38 33.67,15.47 33.67,14.56 33.67,13.65 33.67,12.74 33.67,11.83 33.67,10.92 33.67,10.01 33.67,9.1 33.67,8.19 32.76,18.2 32.76,17.29 32.76,16.38 32.76,15.47 32.76,14.56 32.76,13.65 32.76,12.74 32.76,11.83 32.76,10.92 32.76,10.01 32.76,9.1 32.76,8.19
  pour Top (rank 3, no thermals): -4,52 -4,-2 67,-2 67,52
  pour Bottom (no thermals): 31.82,7.18 45.09,7.18 45.09,21.74 41.85,24.98 31.82,24.98
VCC_IN
  Bottom 0.152: 61,4.57 EDGE1.P$27
  Bottom 0.254: 56.45,36.65 58.32,34.78 58.32,10.93 61,8.25 61,4.57